# Altium schematic sheet TopV4.SchDoc
size B; Organization: Cornell University; DocumentNumber: 1 of 11; SheetNumber: 1; SheetTotal: 11; DocumentName: Top Sheet; ProjectName: OAAN
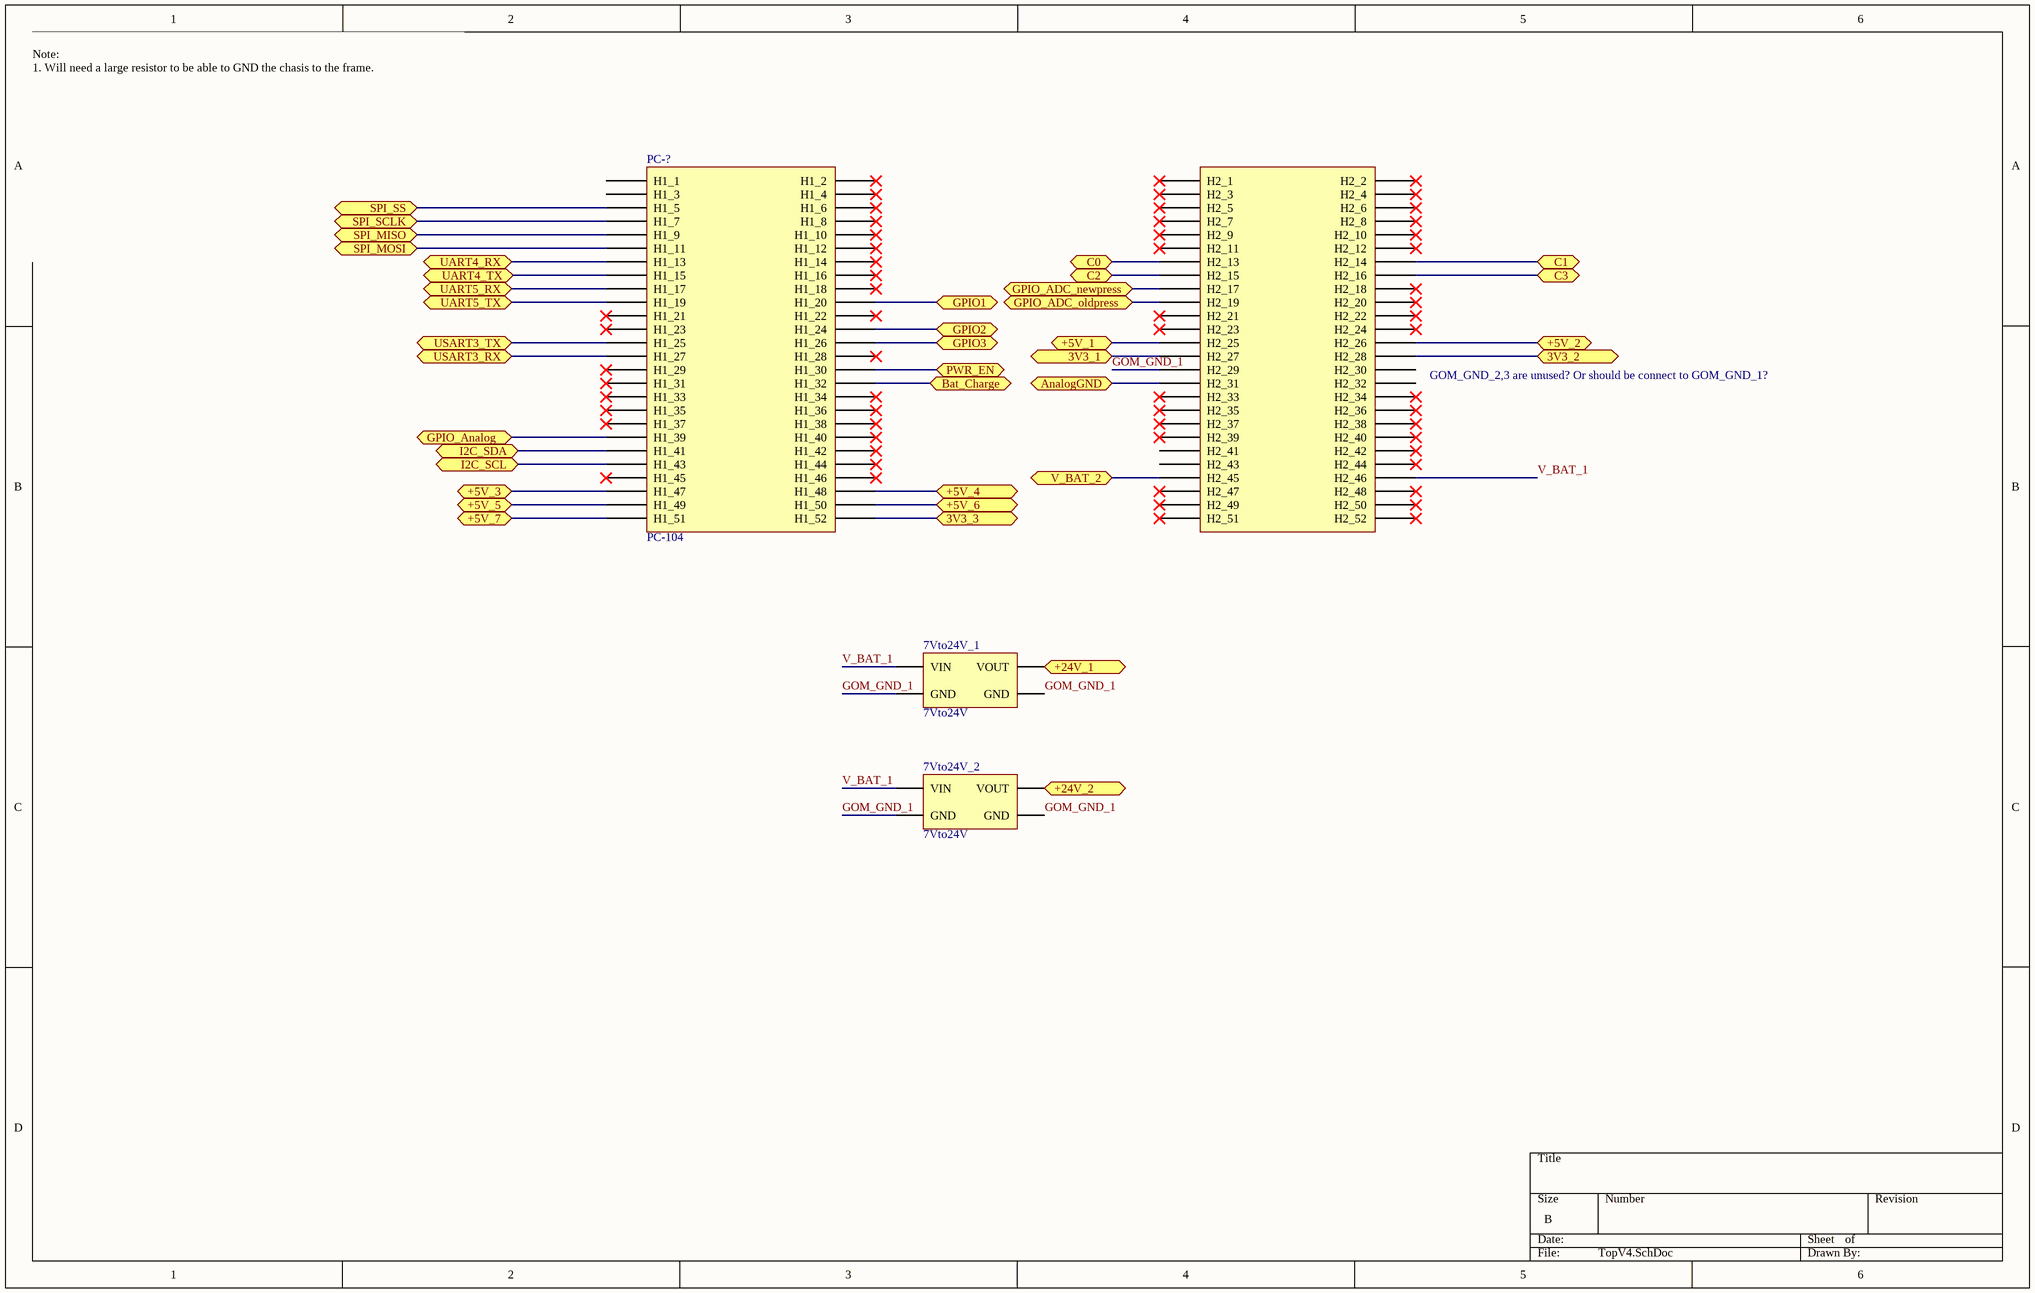
[diagram p0: TopV4.SchDoc]

## Parts
7Vto24V_1  7Vto24V  [7Vto24V]
7Vto24V_2  7Vto24V  [7Vto24V]
PC-?  PC-104  [PC-104FOOTPRINT]

## Ports
3V3_1 (bidir), 3V3_2 (bidir), 3V3_3 (bidir), +5V_1 (bidir), +5V_2 (bidir), +5V_3 (bidir), +5V_4 (bidir), +5V_5 (bidir), +5V_6 (bidir), +5V_7 (bidir), +24V_1 (bidir), +24V_2 (bidir), AnalogGND (bidir), Bat_Charge (bidir), C0 (bidir), C1 (bidir), C2 (bidir), C3 (bidir), GPIO1 (bidir), GPIO2 (bidir), GPIO3 (bidir), GPIO_ADC_newpress (bidir), GPIO_ADC_oldpress (bidir), GPIO_Analog (bidir), I2C_SCL (bidir), I2C_SDA (bidir), PWR_EN (bidir), SPI_MISO (bidir), SPI_MOSI (bidir), SPI_SCLK (bidir), SPI_SS (bidir), UART4_RX (bidir), UART4_TX (bidir), UART5_RX (bidir), UART5_TX (bidir), USART3_RX (bidir), USART3_TX (bidir), V_BAT_2 (bidir)

## Nets
3V3_1: PC-?.H2_27 ; port 3V3_1
3V3_2: PC-?.H2_28 ; port 3V3_2
3V3_3: PC-?.H1_52 ; port 3V3_3
+5V_1: PC-?.H2_25 ; port +5V_1
+5V_2: PC-?.H2_26 ; port +5V_2
+5V_3: PC-?.H1_47 ; port +5V_3
+5V_4: PC-?.H1_48 ; port +5V_4
+5V_5: PC-?.H1_49 ; port +5V_5
+5V_6: PC-?.H1_50 ; port +5V_6
+5V_7: PC-?.H1_51 ; port +5V_7
+24V_1: 7Vto24V_1.2(VOUT) ; port +24V_1
+24V_2: 7Vto24V_2.2(VOUT) ; port +24V_2
AnalogGND: PC-?.H2_31 ; port AnalogGND
Bat_Charge: PC-?.H1_32 ; port Bat_Charge
C0: PC-?.H2_13 ; port C0
C1: PC-?.H2_14 ; port C1
C2: PC-?.H2_15 ; port C2
C3: PC-?.H2_16 ; port C3
GOM_GND_1: 7Vto24V_1.3(GND) 7Vto24V_1.4(GND) 7Vto24V_2.3(GND) 7Vto24V_2.4(GND) PC-?.H2_29
GPIO1: PC-?.H1_20 ; port GPIO1
GPIO2: PC-?.H1_24 ; port GPIO2
GPIO3: PC-?.H1_26 ; port GPIO3
GPIO_ADC_newpress: PC-?.H2_17 ; port GPIO_ADC_newpress
GPIO_ADC_oldpress: PC-?.H2_19 ; port GPIO_ADC_oldpress
GPIO_Analog: PC-?.H1_39 ; port GPIO_Analog
I2C_SCL: PC-?.H1_43 ; port I2C_SCL
I2C_SDA: PC-?.H1_41 ; port I2C_SDA
PWR_EN: PC-?.H1_30 ; port PWR_EN
SPI_MISO: PC-?.H1_9 ; port SPI_MISO
SPI_MOSI: PC-?.H1_11 ; port SPI_MOSI
SPI_SCLK: PC-?.H1_7 ; port SPI_SCLK
SPI_SS: PC-?.H1_5 ; port SPI_SS
UART4_RX: PC-?.H1_13 ; port UART4_RX
UART4_TX: PC-?.H1_15 ; port UART4_TX
UART5_RX: PC-?.H1_17 ; port UART5_RX
UART5_TX: PC-?.H1_19 ; port UART5_TX
USART3_RX: PC-?.H1_27 ; port USART3_RX
USART3_TX: PC-?.H1_25 ; port USART3_TX
V_BAT_1: 7Vto24V_1.1(VIN) 7Vto24V_2.1(VIN) PC-?.H2_46
V_BAT_2: PC-?.H2_45 ; port V_BAT_2

Not connected (* = marked no-connect by the designer): PC-? H1_1 H1_2* H1_3 H1_4* H1_6* H1_8* H1_10* H1_12* H1_14* H1_16* H1_18* H1_21* H1_22* H1_23* H1_28* H1_29* H1_31* H1_33* H1_34* H1_35* H1_36* H1_37* H1_38* H1_40* H1_42* H1_44* H1_45* H1_46* H2_1* H2_2* H2_3* H2_4* H2_5* H2_6* H2_7* H2_8* H2_9* H2_10* H2_11* H2_12* H2_18* H2_20* H2_21* H2_22* H2_23* H2_24* H2_30 H2_32 H2_33* H2_34* H2_35* H2_36* H2_37* H2_38* H2_39* H2_40* H2_41 H2_42* H2_43 H2_44* H2_47* H2_48* H2_49* H2_50* H2_51* H2_52*

## Notes on the sheet
- Note:
  1. Will need a large resistor to be able to GND the chasis to the frame.
- GOM_GND_2,3 are unused? Or should be connect to GOM_GND_1?

## Library data of the parts
PC-? = PC-104: ESQ-126-14-G-D (2 total needed)